# EAGLE design DISCHARGE (EAGLE 9.4.0)
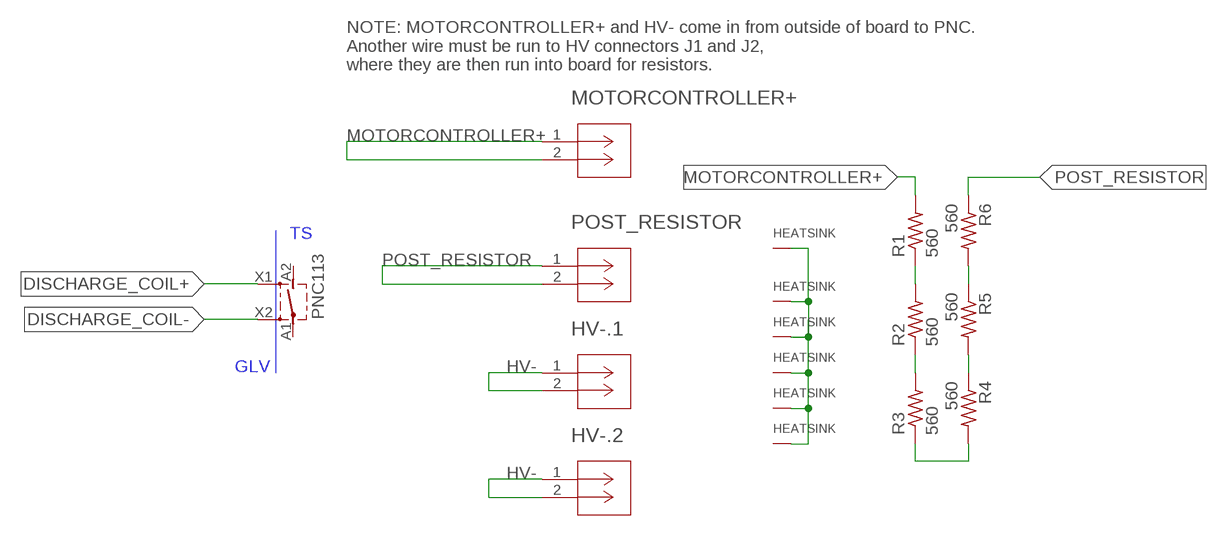
[diagram p0: schematic, sheet 1]

## Parts
HV-.1  770966-1  [CONN2_770966-1]
HV-.2  770966-1  [CONN2_770966-1]
MOTORCONTROLLER+  770966-1  [CONN2_770966-1]
PNC113  PNC113  [PNC113]
POST_RESISTOR  770966-1  [CONN2_770966-1]
R1  560  PF1262-HEATSINKTO126  [TO126]
R2  560  PF1262-HEATSINKTO126  [TO126]
R3  560  PF1262-HEATSINKTO126  [TO126]
R4  560  PF1262-HEATSINKTO126  [TO126]
R5  560  PF1262-HEATSINKTO126  [TO126]
R6  560  PF1262-HEATSINKTO126  [TO126]

## Nets
DISCHARGE_COIL+: PNC113.X1
DISCHARGE_COIL-: PNC113.X2
HEATSINK: R1.THERM R2.THERM R3.THERM R4.THERM R5.THERM R6.THERM
HV-: HV-.1.1 HV-.1.2 HV-.2.1 HV-.2.2
MOTORCONTROLLER+: MOTORCONTROLLER+.1 MOTORCONTROLLER+.2 R1.2
N$1: R5.1 R6.2
N$2: R4.1 R5.2
N$3: R3.1 R4.2
N$4: R2.1 R3.2
N$5: R1.1 R2.2
POST_RESISTOR: POST_RESISTOR.1 POST_RESISTOR.2 R6.1
Unconnected: PNC113.A1 PNC113.A2

## Notes on the sheet
- NOTE: MOTORCONTROLLER+ and HV- come in from outside of board to PNC.
  Another wire must be run to HV connectors J1 and J2,
  where they are then run into board for resistors.
- TS
- GLV

## Library data of the parts
HV-.1 HV-.2 MOTORCONTROLLER+ POST_RESISTOR = IowaFormula:770966-1; MANUFACTURER_PART_NUMBER: 7709661; VENDOR: TE Connectivity
PNC113 = IowaFormula:PNC113
R1-R6 = PF1262:PF1262-HEATSINK: PF126 - Riedon TO-126 Resistor (Heatsink) Reauthored: github.com/michaelpass (04/02/2019)

## Board
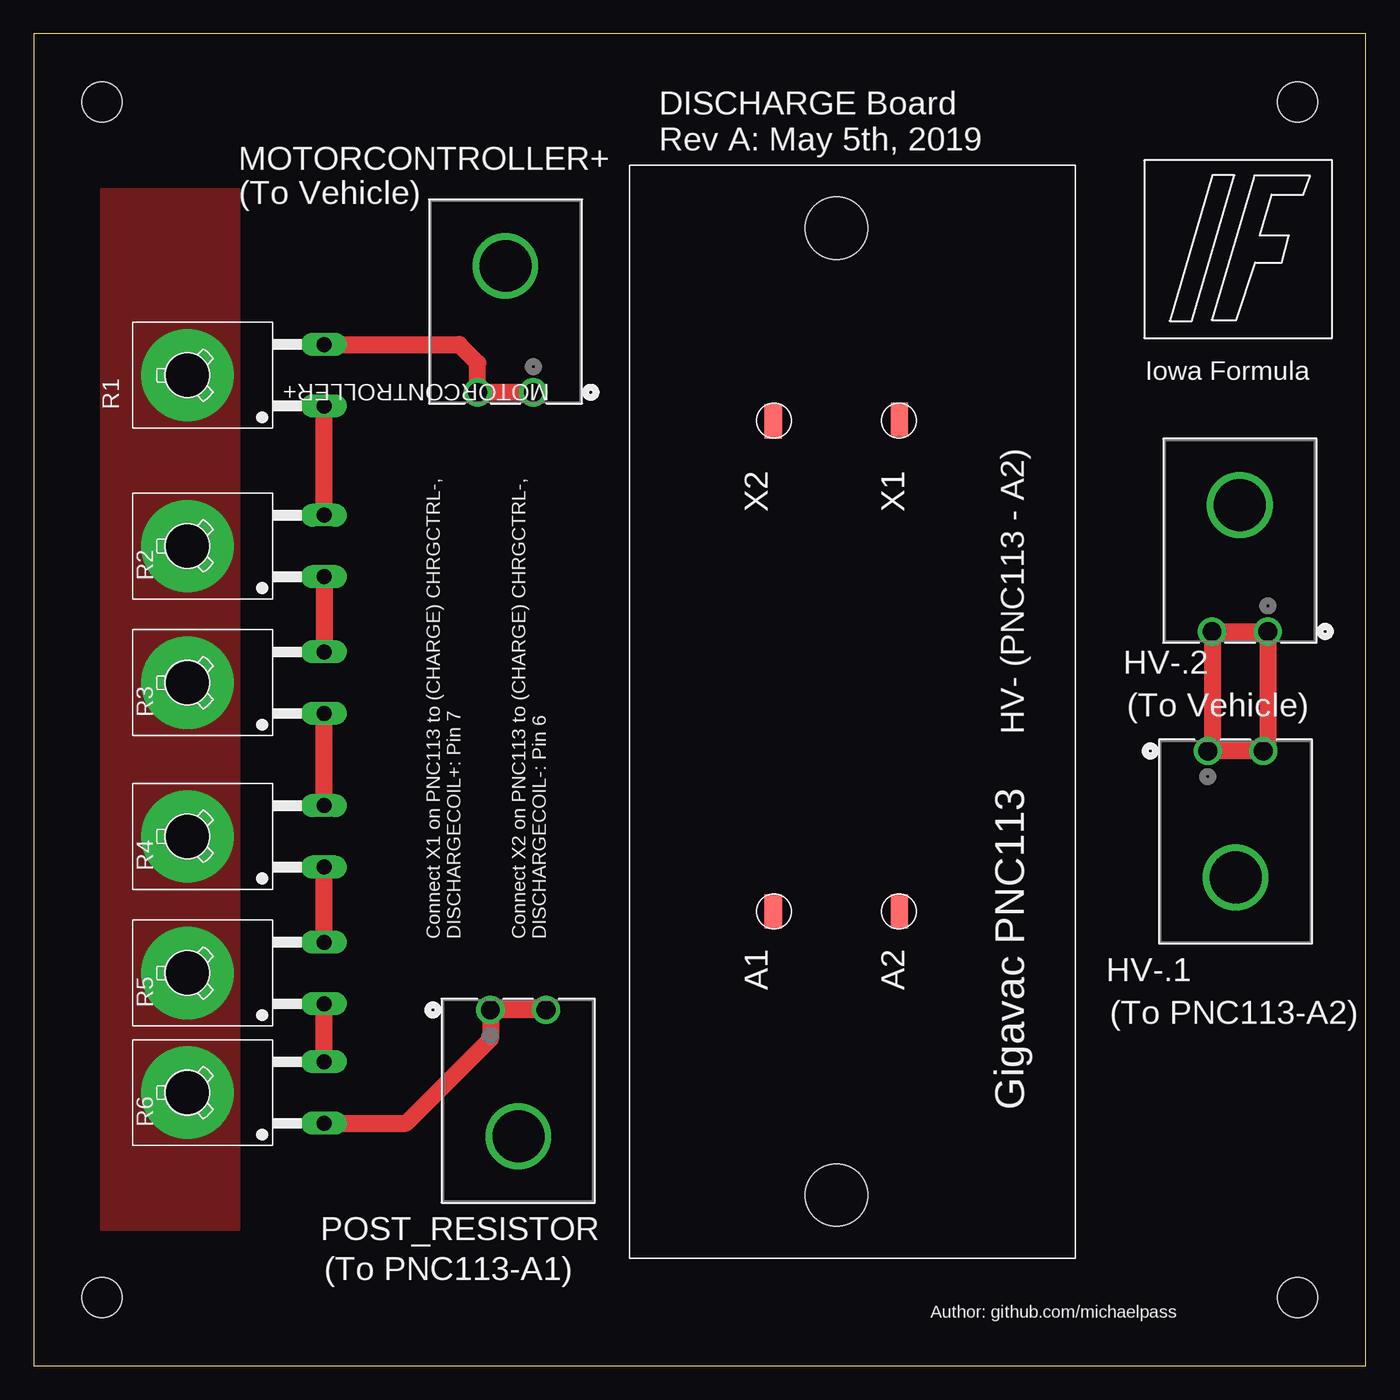
[diagram p1: board, top side]
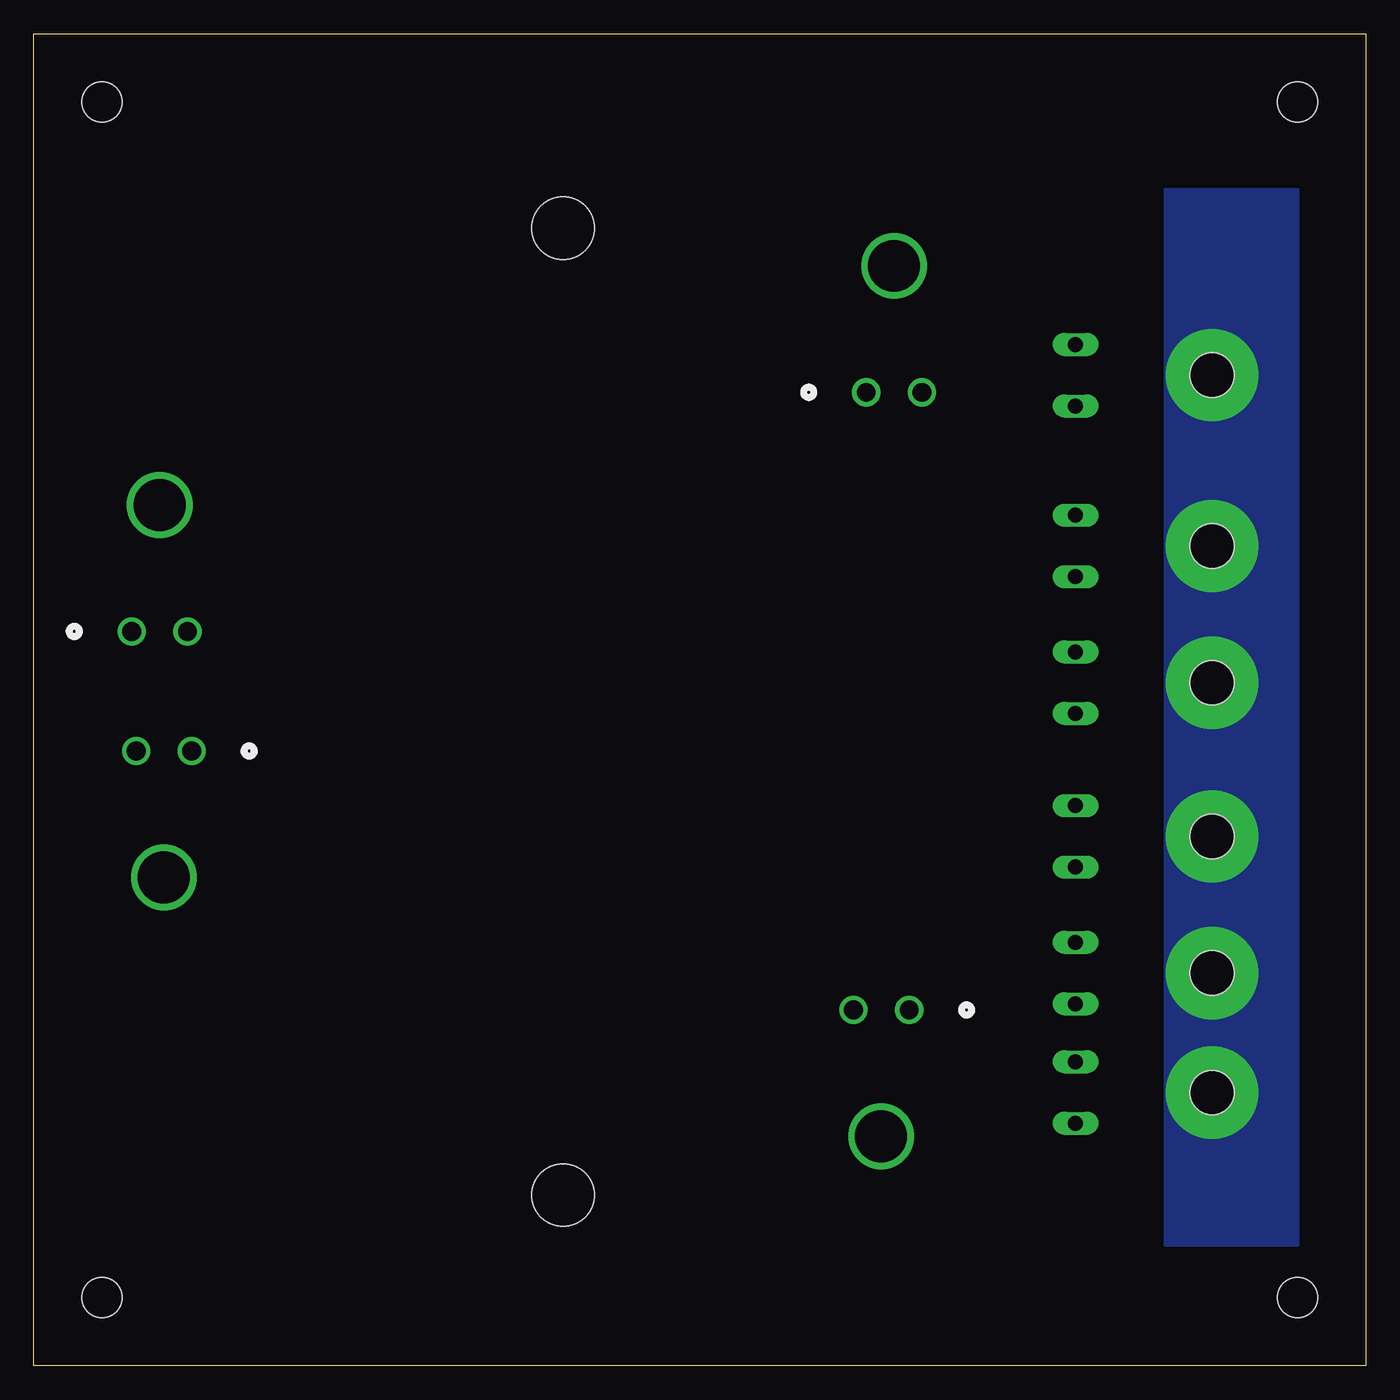
[diagram p2: board, bottom side, seen from below]

Size 99.06 x 99.06 mm. Coordinates in mm from the lower left corner, seen from the top.
Outline: 0,0 99.06,0 99.06,99.06 0,99.06 0,0
Copper layers (1*16): Top 0.035mm / dielectric 1.5mm / Bottom 0.035mm
Design rules "default *": minimum track width 8mil, minimum drill 20mil, track to track 8mil, track to pad 8mil, pad to pad 8mil, via to via 8mil, smd to smd 8mil, copper to edge 10mil, drill to drill 8mil, minimum pad ring 12mil, minimum via ring 10mil, stop-mask expansion 4mil, vias tented up to drill 25mil, thermal gap 10mil
Holes 3 mm at 5.08,5.08 93.98,5.08 93.98,93.98 5.08,93.98

### Footprints (pad centres in the part's own frame; a part is rotated, then mirrored left to right if it is on the bottom)
CONN2_770966-1 = drill 1.397 pad 1.905: 1 -4.14,0; 2 0,0 | drill 3.861 pad 3.861: 3 -2.057,-9.398
PNC113 = smd 2.54 x 1.27: A1 21.082,4.699; A2 21.082,-4.699; X1 57.658,-4.699; X2 57.531,4.699 | hole 4.648: 0,0; 71.882,0
TO126 = drill 1.118 long: 1 -2.286,-5.08; 2 2.286,-5.08 | drill 3.302 pad 6.858: THERM 0,5.08 | hole 3.302: 0,5.08

### Placement (x,y rotation side)
HV-.1  91.44,45.72 0 top
HV-.2  87.63,54.61 180 top
MOTORCONTROLLER+  33.02,72.39 180 top
PNC113  59.69,12.7 90 top
POST_RESISTOR  38.1,26.47 0 top
R1  16.51,73.66 90 top
R2  16.51,60.96 90 top
R3  16.51,50.8 90 top
R4  16.51,39.37 90 top
R5  16.51,29.21 90 top
R6  16.51,20.32 90 top

### Tracks (layer width: path | path; a pad name or v marks a point on that pad's centre or on a via)
HEATSINK
  pour Top (isolate 0.406, no thermals): 15.24,87.45 15.24,10.16 5.08,10.16 5.08,87.45
  pour Bottom (isolate 0.406, no thermals): 14.91,87.45 14.91,8.99 5.08,8.99 5.08,87.45
HV-
  Top 1.27: HV-.2.2 HV-.2.1 91.77,46.05 HV-.1.2 HV-.1.1 87.63,46.05 HV-.2.2
MOTORCONTROLLER+
  Top 1.27: R1.2 31.65,75.95 33.02,74.57 MOTORCONTROLLER+.2 MOTORCONTROLLER+.1
N$1
  Top 1.27: R6.2 R5.1
N$2
  Top 1.27: R5.2 R4.1
N$3
  Top 1.27: R4.2 R3.1
N$4
  Top 1.27: R2.1 R3.2
N$5
  Top 1.27: R2.2 R1.1
POST_RESISTOR
  Top 1.27: POST_RESISTOR.2 POST_RESISTOR.1 33.96,24.31 27.69,18.03 R6.1

### Text on the board
tPlace: (To Vehicle) | (To Vehicle) | Connect X1 on PNC113 to (CHARGE) CHRGCTRL-, / DISCHARGECOIL+: Pin 7 | Connect X2 on PNC113 to (CHARGE) CHRGCTRL-, / DISCHARGECOIL-: Pin 6 | (To PNC113-A2)
tNames: DISCHARGE Board / Rev A: May 5th, 2019 | MOTORCONTROLLER+ | Iowa Formula | HV- (PNC113 - A2) | (To PNC113-A1) | Author: github.com/michaelpass